# Altium schematic sheet USBC-DEV-2.0.SchDoc
size A; SheetNumber: 10; SheetTotal: 9
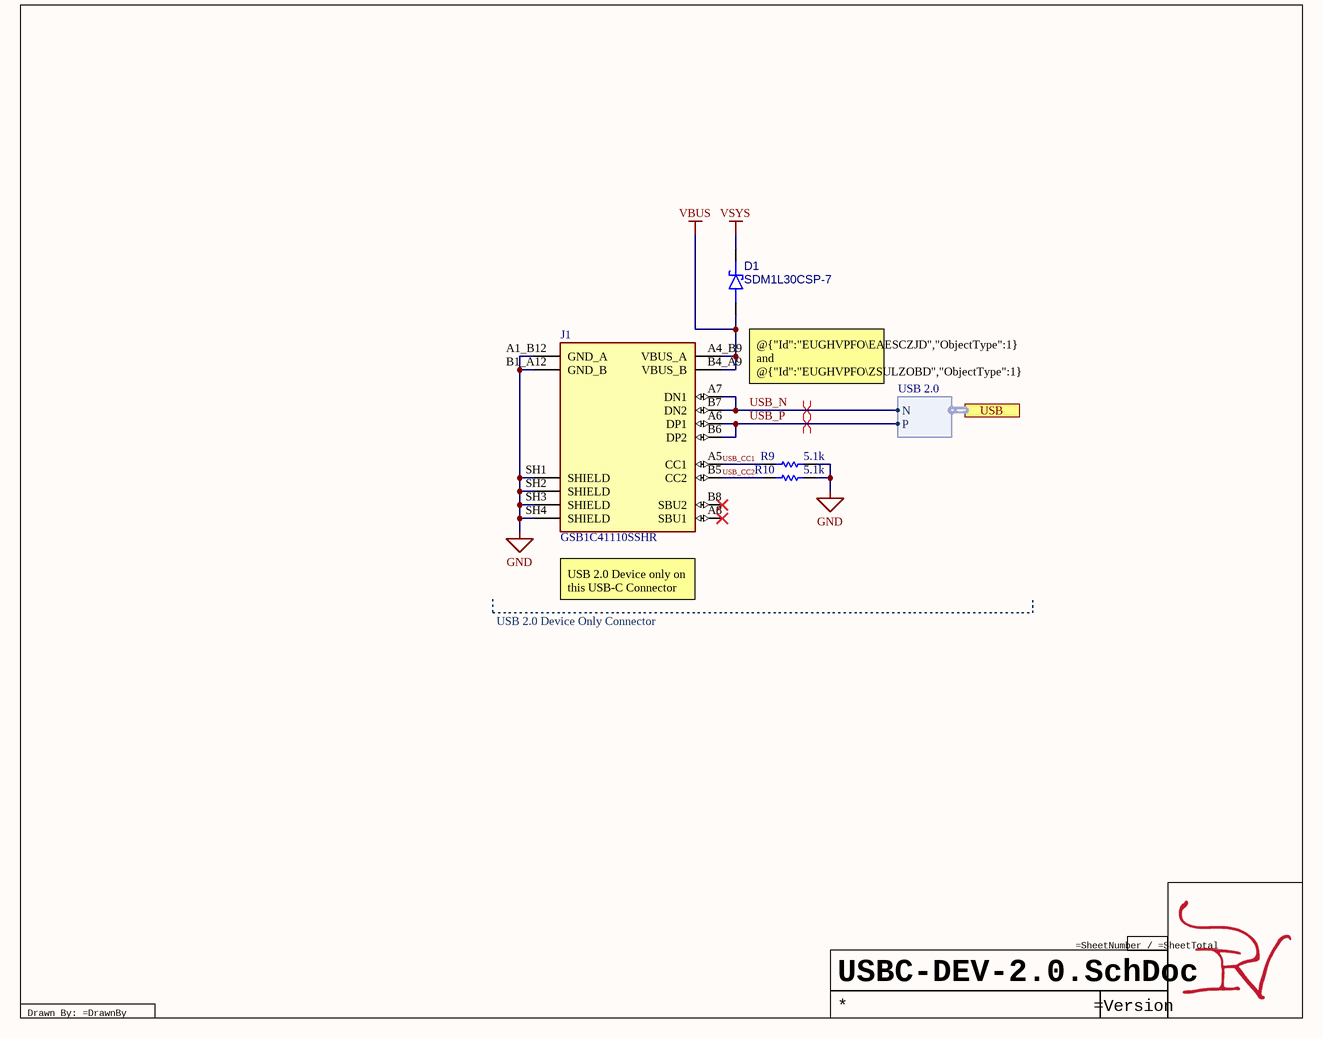
[diagram p0: USBC-DEV-2.0.SchDoc]

## Parts
D1  SDM1L30CSP-7  [SDM1L30CSP-7-Footprint-1]
J1  GSB1C41110SSHR  [AMPHENOL_GSB1C41110SSHR]
R9  value 5.1k  [RES 0201_0603]  (hidden comment: 5k1-0201-0.05/1)
R10  value 5.1k  [RES 0201_0603]  (hidden comment: 5k1-0201-0.05/1)

## Ports
USB (harness USB 2.0, see Connectors[2C], RP2040[1B])

## Harnesses
USB 2.0: N, P

## Nets
GND: J1.A1_B12(GND_A) J1.B1_A12(GND_B) J1.SH1(SHIELD) J1.SH2(SHIELD) J1.SH3(SHIELD) J1.SH4(SHIELD) R9.2 R10.2
VBUS: D1.2(A) J1.A4_B9(VBUS_A) J1.B4_A9(VBUS_B)
VSYS: D1.1(K)
USB_CC1: J1.A5(CC1) R9.1
USB_CC2: J1.B5(CC2) R10.1
USB_N: J1.A7(DN1) J1.B7(DN2) ; port USB.N
USB_P: J1.A6(DP1) J1.B6(DP2) ; port USB.P

Not connected (* = marked no-connect by the designer): J1 A8(SBU1)* B8(SBU2)*

## Layout directives
differential pair: USB_N, USB_P

## Notes on the sheet
- (near D1) @{"Id":"EUGHVPFO\EAESCZJD","ObjectType":1} and @{"Id":"EUGHVPFO\ZSULZOBD","ObjectType":1} pull-up resistors are handled by RP2040
- USB 2.0 Device Only Connector
- (near J1) USB 2.0 Device only on this USB-C Connector
- Drawn By: =DrawnBy

## Library data of the parts
D1 = CMP-004-00005-2: Rectifier Diode, Schottky, 1 Phase, 1 Element, 1A, 30V V(RRM), Silicon; Package Body Material: Plastic; Number of Elements: 1; Terminal Finish: Copper; Min Operating Temperature: -55°C; Reach SVHC Compliant: Yes; Diode Type: RECTIFIER; Moisture Sensitivity Level: 1; Max Output current: 1A; Surface Mount: Yes; RoHS Compliant: Yes; Package Shape: Rectangular; Pins: 2; Terminal Position: BOTTOM; Rep Pk Reverse Voltage-Max: 30V; Max Operating Temperature: 150°C; Package Style: CHIP CARRIERMeter; JESD-609 Code: e2; Technology: SCHOTTKY; Terminal Form: No Lead; Diode Element Material: SILICON
J1 = CMP-786-000000-3: USB2.0, Type C, Top Mount, Center Height 1.63MM, Single Row SMT; MF: {'manufacturer': u'Amphenol Canada'}; Package: None; Value: *; Design Item ID: GSB1C41110SSHR; Availability: Unavailable; MP: GSB1C41110SSHR; Source: GSB1C41110SSHR.SchLib; Price: None
R9 R10 = CMP-009-00053-1: Fixed Resistor, Metal Glaze/thick Film, 0.05W, 5100ohm, 25V, 1% +/-Tol, 200ppm/Cel, Surface Mount, 0201; Power: 50mW; Reference Standard: AEC-Q200; Temperature Coefficient: 200ppm/°C; Package Width: 0.3mm; Rated Temperature: 70°C; Package Height: 0.23mm; Package Length: 0.6mm; Min Operating Temperature: -55°C; Max Operating Temperature: 125°C; Tolerance: 1%; Pins: 2; Case/Package: 0201; Construction: Rectangular; Packaging: Tape and Reel; JESD-609 Code: e3; Terminal Finish: Nickel; Termination: Wraparound; Package Style: SMTMeter; Working Voltage: 25V; Package Shape: Rectangular; Resistor Type: FIXED RESISTOR; RoHS Compliant: Yes; Reach SVHC Compliant: Yes; Mounting Technology: Surface Mount; Technology: METAL GLAZE/THICK FILM